# Altium schematic sheet Raspberry_main.SchDoc
size A4; SheetNumber: 2; SheetTotal: 7
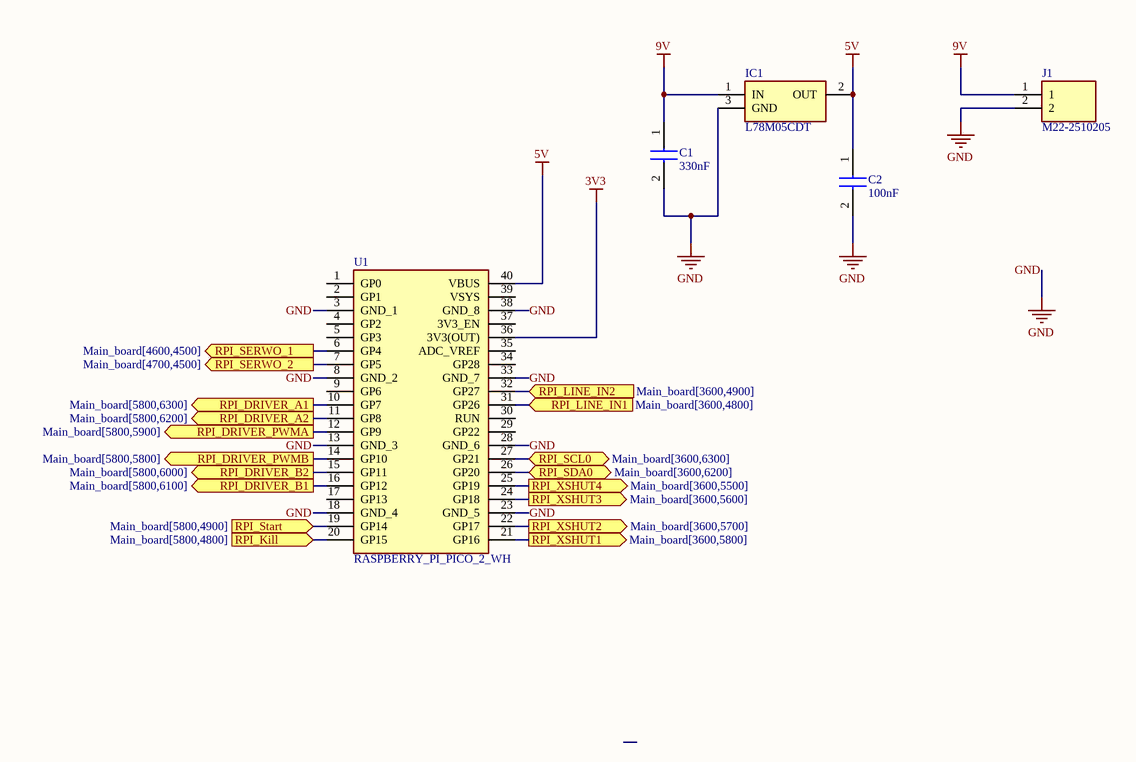
[diagram p0: Raspberry_main.SchDoc]

## Parts
C1  330nF  [CAPC1608X87N]
C2  100nF  [CAPC1608X90N]
IC1  L78M05CDT  [TO225P972X240-3N]
J1  M22-2510205  [PCB 2 pin pads]
U1  RASPBERRY_PI_PICO_2_WH  [RASPBERRYPIPICO2WH]

## Ports
RPI_DRIVER_A1 (out, see Main_board[5800,6300]), RPI_DRIVER_A2 (out, see Main_board[5800,6200]), RPI_DRIVER_B1 (out, see Main_board[5800,6100]), RPI_DRIVER_B2 (out, see Main_board[5800,6000]), RPI_DRIVER_PWMA (out, see Main_board[5800,5900]), RPI_DRIVER_PWMB (out, see Main_board[5800,5800]), RPI_Kill (in, see Main_board[5800,4800]), RPI_LINE_IN1 (in, see Main_board[3600,4800]), RPI_LINE_IN2 (in, see Main_board[3600,4900]), RPI_SCL0 (bidir, see Main_board[3600,6300]), RPI_SDA0 (bidir, see Main_board[3600,6200]), RPI_SERWO_1 (out, see Main_board[4600,4500]), RPI_SERWO_2 (out, see Main_board[4700,4500]), RPI_Start (in, see Main_board[5800,4900]), RPI_XSHUT1 (out, see Main_board[3600,5800]), RPI_XSHUT2 (out, see Main_board[3600,5700]), RPI_XSHUT3 (out, see Main_board[3600,5600]), RPI_XSHUT4 (out, see Main_board[3600,5500])

## Nets
3V3: U1.36(3V3(OUT))
5V: C2.1 IC1.2(OUT) U1.40(VBUS)
9V: C1.1 IC1.1(IN) J1.1
GND: C1.2 C2.2 IC1.3(GND) J1.2 U1.3(GND_1) U1.8(GND_2) U1.13(GND_3) U1.18(GND_4) U1.23(GND_5) U1.28(GND_6) U1.33(GND_7) U1.38(GND_8)
RPI_DRIVER_A1: U1.10(GP7) ; port RPI_DRIVER_A1
RPI_DRIVER_A2: U1.11(GP8) ; port RPI_DRIVER_A2
RPI_DRIVER_B1: U1.16(GP12) ; port RPI_DRIVER_B1
RPI_DRIVER_B2: U1.15(GP11) ; port RPI_DRIVER_B2
RPI_DRIVER_PWMA: U1.12(GP9) ; port RPI_DRIVER_PWMA
RPI_DRIVER_PWMB: U1.14(GP10) ; port RPI_DRIVER_PWMB
RPI_Kill: U1.20(GP15) ; port RPI_Kill
RPI_LINE_IN1: U1.31(GP26) ; port RPI_LINE_IN1
RPI_LINE_IN2: U1.32(GP27) ; port RPI_LINE_IN2
RPI_SCL0: U1.27(GP21) ; port RPI_SCL0
RPI_SDA0: U1.26(GP20) ; port RPI_SDA0
RPI_SERWO_1: U1.6(GP4) ; port RPI_SERWO_1
RPI_SERWO_2: U1.7(GP5) ; port RPI_SERWO_2
RPI_Start: U1.19(GP14) ; port RPI_Start
RPI_XSHUT1: U1.21(GP16) ; port RPI_XSHUT1
RPI_XSHUT2: U1.22(GP17) ; port RPI_XSHUT2
RPI_XSHUT3: U1.24(GP18) ; port RPI_XSHUT3
RPI_XSHUT4: U1.25(GP19) ; port RPI_XSHUT4

Not connected (* = marked no-connect by the designer): U1 1(GP0) 2(GP1) 4(GP2) 5(GP3) 9(GP6) 17(GP13) 29(GP22) 30(RUN) 34(GP28) 35(ADC_VREF) 37(3V3_EN) 39(VSYS)

## Library data of the parts
C1 = 0603X334K250CT: Capacitor; Manufacturer_Name: PSA; Datasheet Link: https://datasheet.lcsc.com/szlcsc/Huaxin-S-T-0603X334K250CT_C237211.pdf; Height: 0.87mm; Manufacturer_Part_Number: 0603X334K250CT
C2 = 06031C104MAT2A: Capacitor; Manufacturer_Name: Kyocera AVX; Datasheet Link: https://componentsearchengine.com/Datasheets/1/06031A100FAT2A.pdf; Height: 0.9mm; Manufacturer_Part_Number: 06031C104MAT2A; Mouser Part Number: 581-06031C104MAT2A; Mouser Price/Stock: https://www.mouser.co.uk/ProductDetail/KYOCERA-AVX/06031C104MAT2A?qs=%252BdQmOuGyFcGxIE8rM3npkw%3D%3D
IC1 = L78M05CDT: Integrated Circuit; Manufacturer_Name: STMicroelectronics; Datasheet Link: http://componentsearchengine.com/Datasheets/1/L78M05CDT.pdf; Manufacturer_Part_Number: L78M05CDT; Mouser Part Number: 511-L78M05CDT; Mouser Price/Stock: https://www.mouser.co.uk/ProductDetail/STMicroelectronics/L78M05CDT?qs=EYQuxaDwR79rnNxSL0UEZA%3D%3D
J1 = M22-2510205: Connector; Manufacturer_Name: Harwin; Datasheet Link: https://content.harwin.com/m/d9a5a31e6cbac1ad/original/DRG-00499-Technical-Drawing-Datasheet-M22-251-pdf.pdf; Height: 5.25mm; Manufacturer_Part_Number: M22-2510205; Mouser Part Number: 855-M22-2510205; Mouser Price/Stock: https://www.mouser.co.uk/ProductDetail/Harwin/M22-2510205?qs=vF78I%252BjhbY%2FHssMovH2Mxg%3D%3D
U1 = RASPBERRY_PI_PICO_2_WH: Undefined or Miscellaneous; Manufacturer_Name: RASPBERRY-PI; Manufacturer_Part_Number: RASPBERRY PI PICO 2 WH; Datasheet Link: https://datasheets.raspberrypi.com/pico/pico-2-product-brief.pdf; Height: 5mm